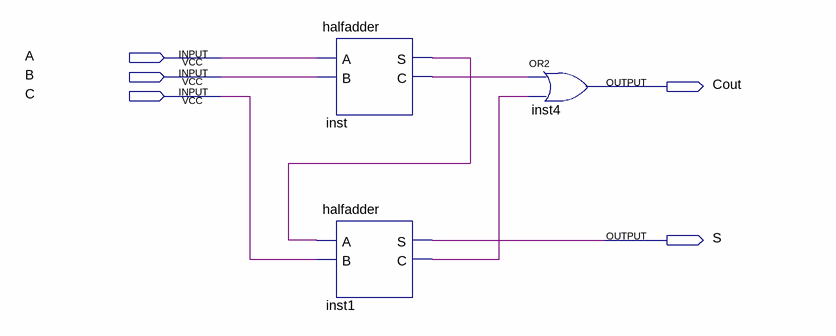
[diagram p0: schematic sheet]
// Quartus schematic fulladder.bdf as structural Verilog: 3 symbols, 5 pins
module fulladder (
  input  A,
  input  B,
  input  C,
  output Cout,
  output S
);

  wire inst1_c, inst_c, inst_s;

  halfadder inst (.A(A), .B(B), .S(inst_s), .C(inst_c));
  halfadder inst1 (.A(inst_s), .B(C), .S(S), .C(inst1_c));
  or inst4 (Cout, inst_c, inst1_c);
endmodule
